# Altium schematic sheet LEDs.SchDoc
size A
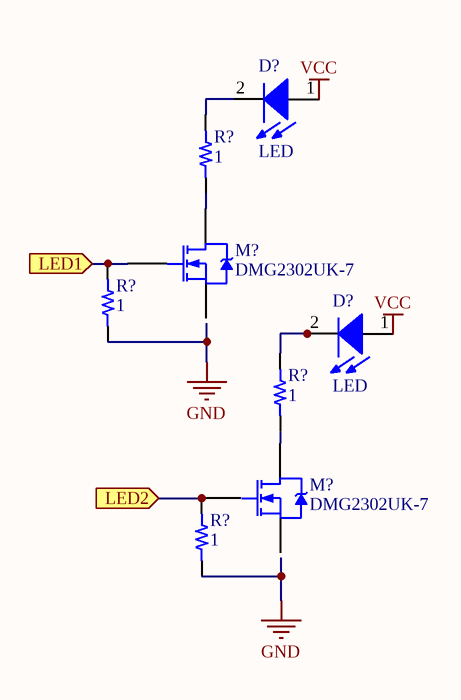
[diagram p0: LEDs.SchDoc]

## Parts
(Parts that share a designator on the sheet are numbered #1, #2 ... from top to bottom, then left to right.)
D?#1  LED  [0805_LED]
D?#2  LED  [0805_LED]
M?#1  DMG2302UK-7  [SOT23-3]
M?#2  DMG2302UK-7  [SOT23-3]
R?#1  1  [RES 0603/1608]
R?#2  resistance: 1  [0603]  (hidden comment: resistor)
R?#3  1  [RES 0603/1608]
R?#4  resistance: 1  [0603]  (hidden comment: resistor)

## Ports
LED1 (in), LED2 (in)

## Nets
GND: R?#2.1 R?#4.1
VCC: D?#1.1(A) D?#2.1(A)
LED1: M?#1.1(G) R?#2.2 ; port LED1
LED2: M?#2.1(G) R?#4.2 ; port LED2
NetD?#1_2: D?#1.2(K) R?#1.2
NetD?#2_2: D?#2.2(K) R?#3.2
NetM?#1_3: M?#1.3(D) R?#1.1
NetM?#2_3: M?#2.3(D) R?#3.1

Not connected (* = marked no-connect by the designer): M?#1 2(S); M?#2 2(S)

## Library data of the parts
D?#1 D?#2 = 1: idLED: 1; Name: LED_0805_RED; Value: Red; Vf: 0.7V; Manufacturer_id: 1; Drawer_id: 1; Package: 0805
M?#1 M?#2 = 6: MOSFET N-CHANNEL 30V 5A SOT23; Manufacturer_id: 1; idFETs: 6; Value: N_Channel; Vdss: 20V; Id: 2.8A; Rds_On: 90mOhm; Vgs(typ): 800mV; Vgs(Max): 1V; Created_By: Angel; MfrPartNo: DMG2302UK-7; Drawer_id: 1; Name: DMG2302UK-7; Num_Circuits: 1; Package: SOT-23; Link: https://www.digikey.com/product-detail/en/diodes-incorporated/DMG2302UK-7/DMG2302UK-7DICT-ND/6010163; Supplier1: Digi-Key
R?#1-R?#4 = 1: name: 0603 Resistor; percent tolerance: 5; id: 1; package: 0603; quantity: 0
  R?#1 R?#3: resistance: 1